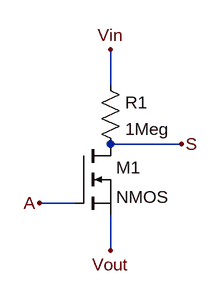
[diagram p0: schematic NNOT.asc]
NNOT.asc, the LTspice schematic file:
Version 4
SHEET 1 880 680
WIRE 176 96 176 48
WIRE 272 176 176 176
WIRE 128 256 80 256
WIRE 176 320 176 272
FLAG 176 48 Vin
FLAG 80 256 A
FLAG 176 320 Vout
FLAG 272 176 S
SYMBOL res 160 80 R0
SYMATTR InstName R1
SYMATTR Value 1Meg
SYMATTR SpiceLine tol=1 pwr=0.1
SYMBOL nmos 128 176 R0
SYMATTR InstName M1

The netlist it stands for:
* NNOT.asc
R1 Vin S 1Meg tol=1 pwr=0.1
M1 S A Vout Vout NMOS
.model NMOS NMOS
.model PMOS PMOS
.lib standard.mos
.backanno
.end